# Altium schematic sheet altium_hier_flash.SchDoc
size A4
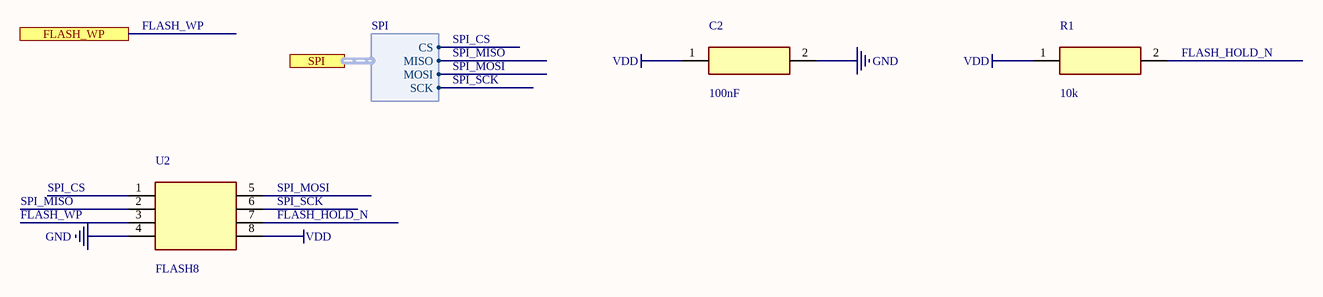
[diagram p0: altium_hier_flash.SchDoc]

## Parts
C2  100nF  [C0603]
R1  10k  [R0603]
U2  FLASH8  [SOIC8]

## Ports
FLASH_WP, SPI (harness SPI)

## Harnesses
SPI: CS, MISO, MOSI, SCK

## Nets
GND: C2.2 U2.4
VDD: C2.1 R1.1 U2.8
FLASH_HOLD_N: R1.2 U2.7
FLASH_WP: U2.3 ; port FLASH_WP
SPI_CS: U2.1 ; port SPI.CS
SPI_MISO: U2.2 ; port SPI.MISO
SPI_MOSI: U2.5 ; port SPI.MOSI
SPI_SCK: U2.6 ; port SPI.SCK

## Library data of the parts
C2 = CAP
R1 = RES